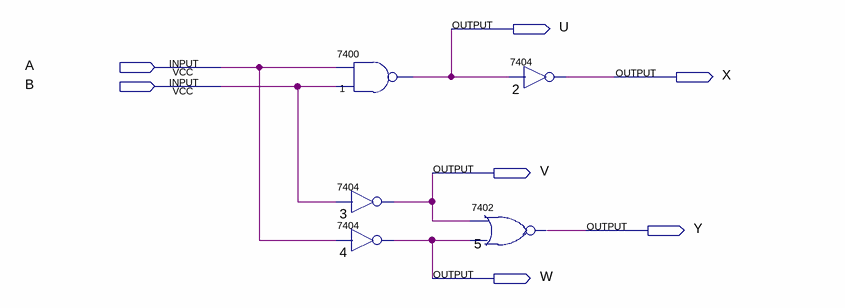
[diagram p0: schematic sheet]
// Quartus schematic Project.bdf as structural Verilog: 5 symbols, 7 pins
module Project (
  input  A,
  input  B,
  output U,
  output X,
  output V,
  output Y,
  output W
);

  \7400  u_1 (.\3 (B), .\2 (A), .\1 (U));
  \7404  u_3 (.\2 (B), .\1 (V));
  \7404  u_4 (.\2 (A), .\1 (W));
  \7404  u_2 (.\2 (U), .\1 (X));
  \7402  u_5 (.\2 (V), .\3 (W), .\1 (Y));
endmodule
